# Altium project ledbrick_plus_led.PrjPcb
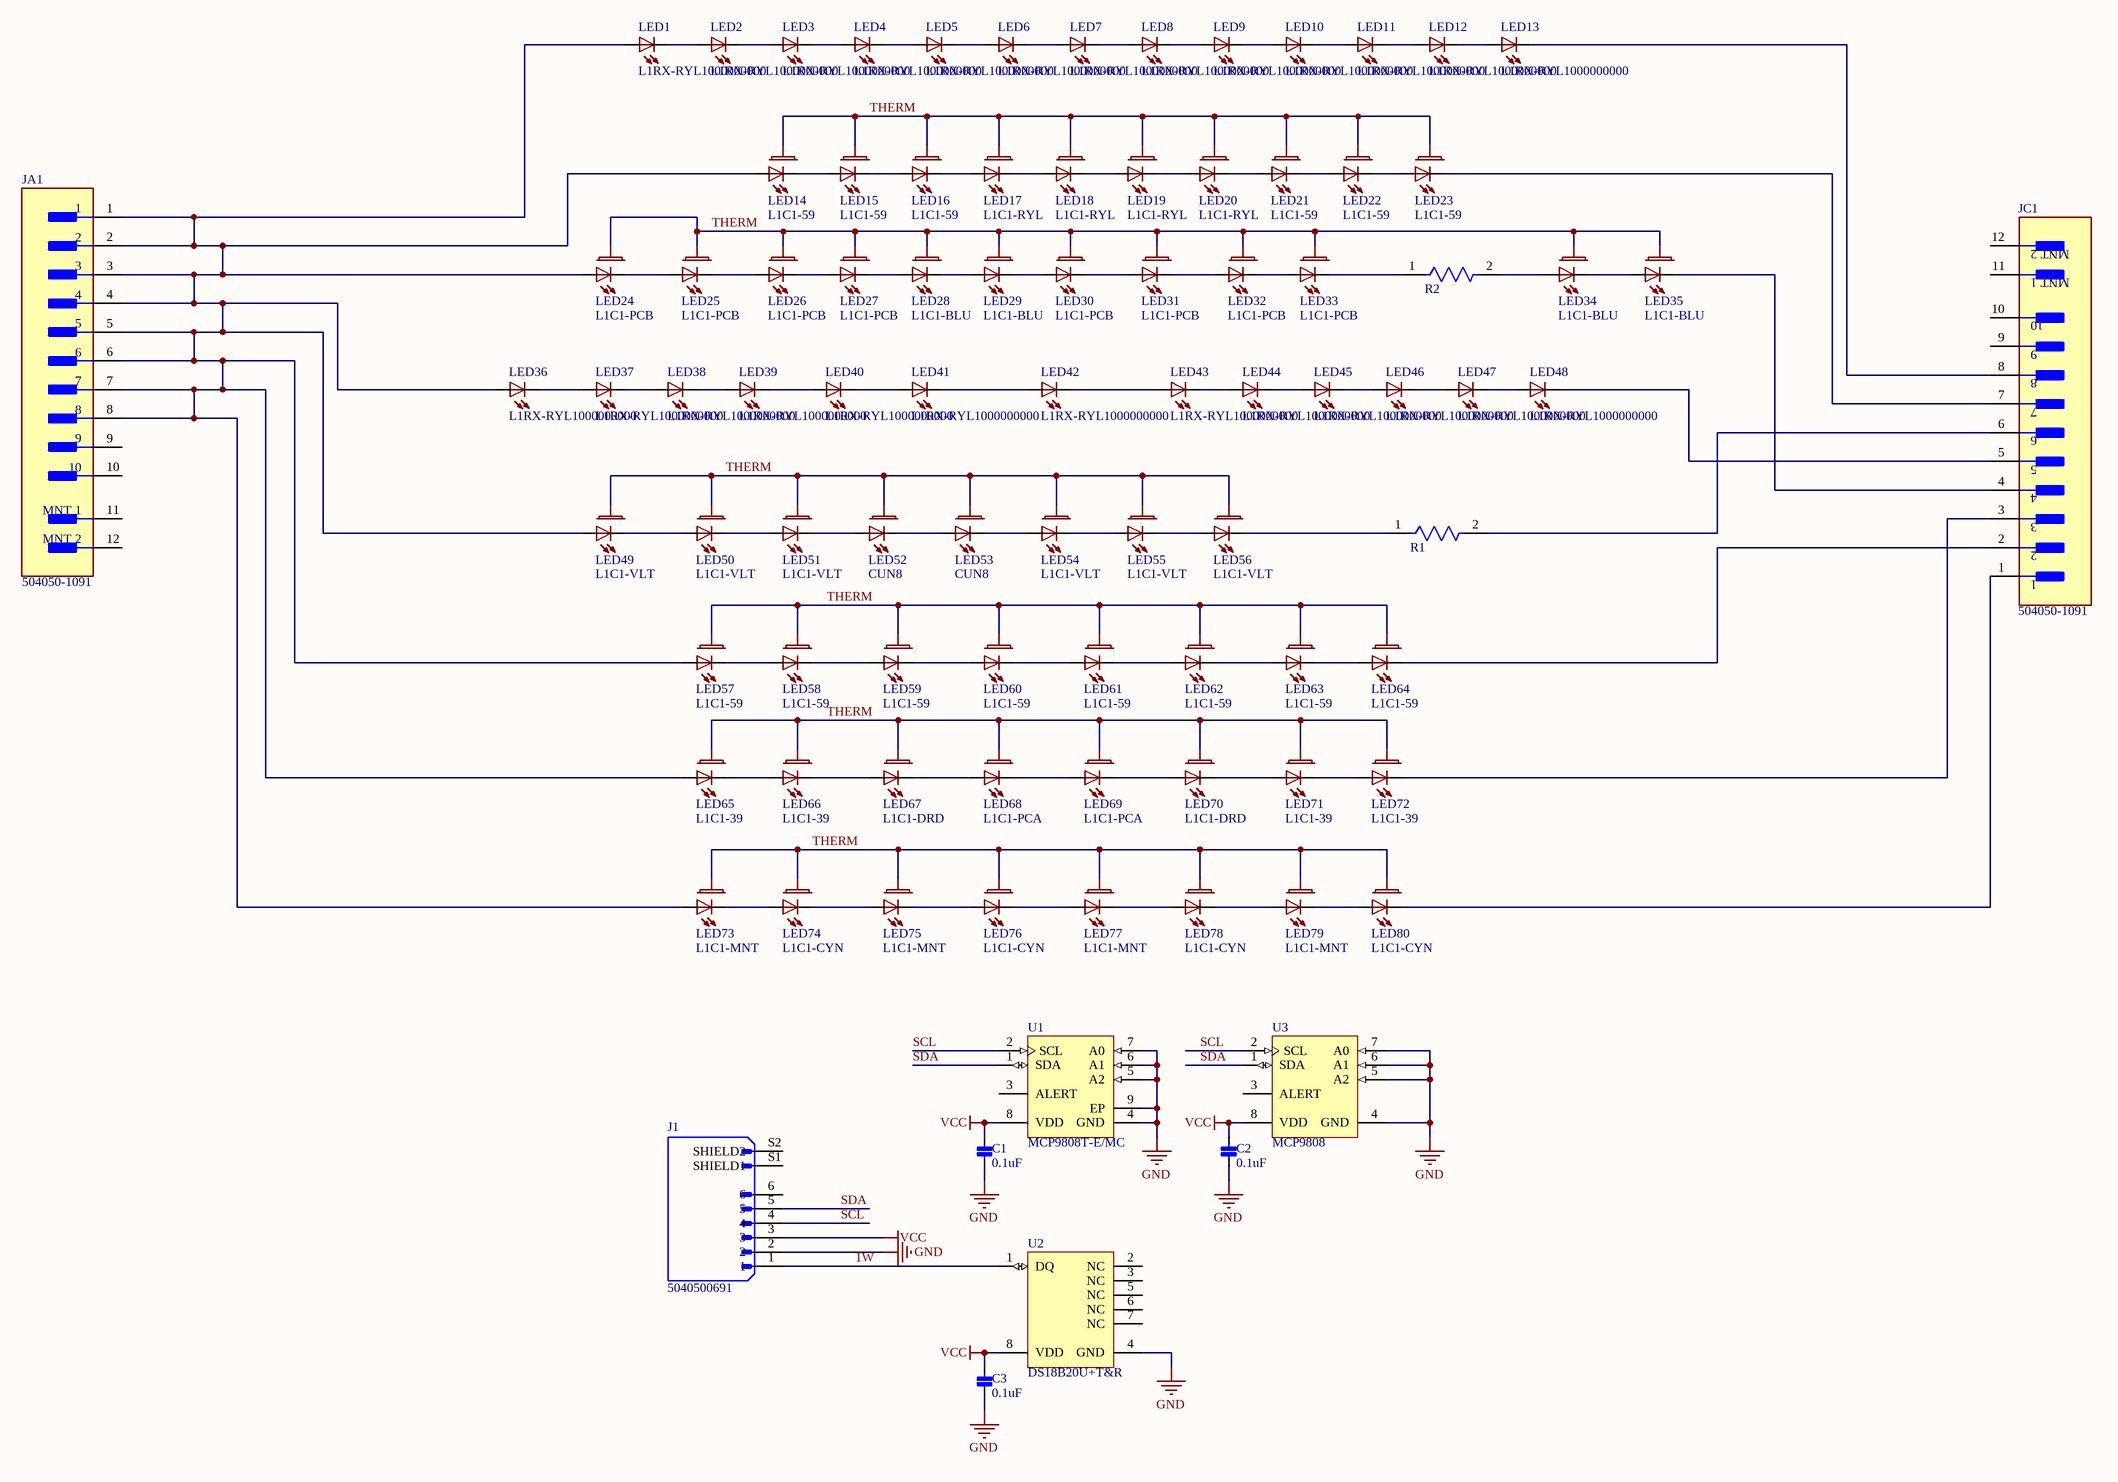
[diagram p0: ledbrick_plus_led.SchDoc]
1 sheet, 91 parts. Net scope: global (net labels, ports and power ports of the same name join across sheets).
Board file: ledbrick_plus_led.PcbDoc

## Sheet ledbrick_plus_led.SchDoc
size C; SheetNumber: 1; SheetTotal: 1

### Parts
C1  value 0.1uF  [FP-CL10-IPC_B]  (hidden comment: CAP 0.1uF 50V X7R 0603)
C2  value 0.1uF  [FP-CL10-IPC_B]  (hidden comment: CAP 0.1uF 50V X7R 0603)
C3  value 0.1uF  [FP-CL10-IPC_B]  (hidden comment: CAP 0.1uF 50V X7R 0603)
J1  5040500691  [MOLEX_5040500691]
JA1  504050-1091  [FP-504050-1091-MFG]
JC1  504050-1091  [FP-504050-1091-MFG]
LED1  L1RX-RYL1000000000  [L1RX-RYL1000000000-Footprint-1]
LED2  L1RX-RYL1000000000  [L1RX-RYL1000000000-Footprint-1]
LED3  L1RX-RYL1000000000  [L1RX-RYL1000000000-Footprint-1]
LED4  L1RX-RYL1000000000  [L1RX-RYL1000000000-Footprint-1]
LED5  L1RX-RYL1000000000  [L1RX-RYL1000000000-Footprint-1]
LED6  L1RX-RYL1000000000  [L1RX-RYL1000000000-Footprint-1]
LED7  L1RX-RYL1000000000  [L1RX-RYL1000000000-Footprint-1]
LED8  L1RX-RYL1000000000  [L1RX-RYL1000000000-Footprint-1]
LED9  L1RX-RYL1000000000  [L1RX-RYL1000000000-Footprint-1]
LED10  L1RX-RYL1000000000  [L1RX-RYL1000000000-Footprint-1]
LED11  L1RX-RYL1000000000  [L1RX-RYL1000000000-Footprint-1]
LED12  L1RX-RYL1000000000  [L1RX-RYL1000000000-Footprint-1]
LED13  L1RX-RYL1000000000  [L1RX-RYL1000000000-Footprint-1]
LED14  L1C1-59  [LUXEON_C_DATASHEET]
LED15  L1C1-59  [LUXEON_C_DATASHEET]
LED16  L1C1-59  [LUXEON_C_DATASHEET]
LED17  L1C1-RYL  [LUXEON_C_DATASHEET]
LED18  L1C1-RYL  [LUXEON_C_DATASHEET]
LED19  L1C1-RYL  [LUXEON_C_DATASHEET]
LED20  L1C1-RYL  [LUXEON_C_DATASHEET]
LED21  L1C1-59  [LUXEON_C_DATASHEET]
LED22  L1C1-59  [LUXEON_C_DATASHEET]
LED23  L1C1-59  [LUXEON_C_DATASHEET]
LED24  L1C1-PCB  [LUXEON_C_DATASHEET]
LED25  L1C1-PCB  [LUXEON_C_DATASHEET]
LED26  L1C1-PCB  [LUXEON_C_DATASHEET]
LED27  L1C1-PCB  [LUXEON_C_DATASHEET]
LED28  L1C1-BLU  [LUXEON_C_DATASHEET]
LED29  L1C1-BLU  [LUXEON_C_DATASHEET]
LED30  L1C1-PCB  [LUXEON_C_DATASHEET]
LED31  L1C1-PCB  [LUXEON_C_DATASHEET]
LED32  L1C1-PCB  [LUXEON_C_DATASHEET]
LED33  L1C1-PCB  [LUXEON_C_DATASHEET]
LED34  L1C1-BLU  [LUXEON_C_DATASHEET]
LED35  L1C1-BLU  [LUXEON_C_DATASHEET]
LED36  L1RX-RYL1000000000  [L1RX-RYL1000000000-Footprint-1]
LED37  L1RX-RYL1000000000  [L1RX-RYL1000000000-Footprint-1]
LED38  L1RX-RYL1000000000  [L1RX-RYL1000000000-Footprint-1]
LED39  L1RX-RYL1000000000  [L1RX-RYL1000000000-Footprint-1]
LED40  L1RX-RYL1000000000  [L1RX-RYL1000000000-Footprint-1]
LED41  L1RX-RYL1000000000  [L1RX-RYL1000000000-Footprint-1]
LED42  L1RX-RYL1000000000  [L1RX-RYL1000000000-Footprint-1]
LED43  L1RX-RYL1000000000  [L1RX-RYL1000000000-Footprint-1]
LED44  L1RX-RYL1000000000  [L1RX-RYL1000000000-Footprint-1]
LED45  L1RX-RYL1000000000  [L1RX-RYL1000000000-Footprint-1]
LED46  L1RX-RYL1000000000  [L1RX-RYL1000000000-Footprint-1]
LED47  L1RX-RYL1000000000  [L1RX-RYL1000000000-Footprint-1]
LED48  L1RX-RYL1000000000  [L1RX-RYL1000000000-Footprint-1]
LED49  L1C1-VLT  [LUXEON_C_DATASHEET]
LED50  L1C1-VLT  [LUXEON_C_DATASHEET]
LED51  L1C1-VLT  [LUXEON_C_DATASHEET]
LED52  CUN8  [VIOSYS_Z5]
LED53  CUN8  [VIOSYS_Z5]
LED54  L1C1-VLT  [LUXEON_C_DATASHEET]
LED55  L1C1-VLT  [LUXEON_C_DATASHEET]
LED56  L1C1-VLT  [LUXEON_C_DATASHEET]
LED57  L1C1-59  [LUXEON_C_DATASHEET]
LED58  L1C1-59  [LUXEON_C_DATASHEET]
LED59  L1C1-59  [LUXEON_C_DATASHEET]
LED60  L1C1-59  [LUXEON_C_DATASHEET]
LED61  L1C1-59  [LUXEON_C_DATASHEET]
LED62  L1C1-59  [LUXEON_C_DATASHEET]
LED63  L1C1-59  [LUXEON_C_DATASHEET]
LED64  L1C1-59  [LUXEON_C_DATASHEET]
LED65  L1C1-39  [LUXEON_C_DATASHEET]
LED66  L1C1-39  [LUXEON_C_DATASHEET]
LED67  L1C1-DRD  [LUXEON_C_DATASHEET]
LED68  L1C1-PCA  [LUXEON_C_DATASHEET]
LED69  L1C1-PCA  [LUXEON_C_DATASHEET]
LED70  L1C1-DRD  [LUXEON_C_DATASHEET]
LED71  L1C1-39  [LUXEON_C_DATASHEET]
LED72  L1C1-39  [LUXEON_C_DATASHEET]
LED73  L1C1-MNT  [LUXEON_C_DATASHEET]
LED74  L1C1-CYN  [LUXEON_C_DATASHEET]
LED75  L1C1-MNT  [LUXEON_C_DATASHEET]
LED76  L1C1-CYN  [LUXEON_C_DATASHEET]
LED77  L1C1-MNT  [LUXEON_C_DATASHEET]
LED78  L1C1-CYN  [LUXEON_C_DATASHEET]
LED79  L1C1-MNT  [LUXEON_C_DATASHEET]
LED80  L1C1-CYN  [LUXEON_C_DATASHEET]
R1  0R 1206  [FP-RC1206-IPC_B]  (value not drawn)
R2  0R 1206  [FP-RC1206-IPC_B]  (value not drawn)
U1  MCP9808T-E/MC  [MCHP-DFN-MC8_V]
U2  DS18B20U+T&R  [MAXM-U8+1_N]
U3  MCP9808  [MCHP-MSOP-MS8_M]

### Nets
GND: C1.2 C2.2 C3.2 J1.2 U1.4(GND) U1.5(A2) U1.6(A1) U1.7(A0) U1.9(EP) U2.4(GND) U3.4(GND) U3.5(A2) U3.6(A1) U3.7(A0)
VCC: C1.1 C2.1 C3.1 J1.3 U1.8(VDD) U2.8(VDD) U3.8(VDD)
1W: J1.1 U2.1(DQ)
SCL: J1.4 U1.2(SCL) U3.2(SCL)
SDA: J1.5 U1.1(SDA) U3.1(SDA)
THERM: LED14.PAD LED15.PAD LED16.PAD LED17.PAD LED18.PAD LED19.PAD LED20.PAD LED21.PAD LED22.PAD LED23.PAD LED24.PAD LED25.PAD LED26.PAD LED27.PAD LED28.PAD LED29.PAD LED30.PAD LED31.PAD LED32.PAD LED33.PAD LED34.PAD LED35.PAD LED49.PAD LED50.PAD LED51.PAD LED52.PAD LED53.PAD LED54.PAD LED55.PAD LED56.PAD LED57.PAD LED58.PAD LED59.PAD LED60.PAD LED61.PAD LED62.PAD LED63.PAD LED64.PAD LED65.PAD LED66.PAD LED67.PAD LED68.PAD LED69.PAD LED70.PAD LED71.PAD LED72.PAD LED73.PAD LED74.PAD LED75.PAD LED76.PAD LED77.PAD LED78.PAD LED79.PAD LED80.PAD
NetJA1_1: JA1.1 JA1.2 JA1.3 JA1.4 JA1.5 JA1.6 JA1.7 JA1.8 LED1.A LED14.A LED24.A LED36.A LED49.A LED57.A LED65.A LED73.A
NetJC1_1: JC1.1 LED80.C
NetJC1_2: JC1.2 LED64.C
NetJC1_3: JC1.3 LED72.C
NetJC1_4: JC1.4 LED35.C
NetJC1_5: JC1.5 LED48.C
NetJC1_6: JC1.6 R1.2
NetJC1_7: JC1.7 LED23.C
NetJC1_8: JC1.8 LED13.C
NetLED1_C: LED1.C LED2.A
NetLED2_C: LED2.C LED3.A
NetLED3_C: LED3.C LED4.A
NetLED4_C: LED4.C LED5.A
NetLED5_C: LED5.C LED6.A
NetLED6_C: LED6.C LED7.A
NetLED7_C: LED7.C LED8.A
NetLED8_C: LED8.C LED9.A
NetLED9_C: LED9.C LED10.A
NetLED10_C: LED10.C LED11.A
NetLED11_C: LED11.C LED12.A
NetLED12_C: LED12.C LED13.A
NetLED14_C: LED14.C LED15.A
NetLED15_C: LED15.C LED16.A
NetLED16_C: LED16.C LED17.A
NetLED17_C: LED17.C LED18.A
NetLED18_C: LED18.C LED19.A
NetLED19_C: LED19.C LED20.A
NetLED20_C: LED20.C LED21.A
NetLED21_C: LED21.C LED22.A
NetLED22_C: LED22.C LED23.A
NetLED24_C: LED24.C LED25.A
NetLED25_C: LED25.C LED26.A
NetLED26_C: LED26.C LED27.A
NetLED27_C: LED27.C LED28.A
NetLED28_C: LED28.C LED29.A
NetLED29_C: LED29.C LED30.A
NetLED30_C: LED30.C LED31.A
NetLED31_C: LED31.C LED32.A
NetLED32_C: LED32.C LED33.A
NetLED33_C: LED33.C R2.1
NetLED34_A: LED34.A R2.2
NetLED34_C: LED34.C LED35.A
NetLED36_C: LED36.C LED37.A
NetLED37_C: LED37.C LED38.A
NetLED38_C: LED38.C LED39.A
NetLED39_C: LED39.C LED40.A
NetLED40_C: LED40.C LED41.A
NetLED41_C: LED41.C LED42.A
NetLED42_C: LED42.C LED43.A
NetLED43_C: LED43.C LED44.A
NetLED44_C: LED44.C LED45.A
NetLED45_C: LED45.C LED46.A
NetLED46_C: LED46.C LED47.A
NetLED47_C: LED47.C LED48.A
NetLED49_C: LED49.C LED50.A
NetLED50_C: LED50.C LED51.A
NetLED51_C: LED51.C LED52.A
NetLED52_C: LED52.C LED53.A
NetLED53_C: LED53.C LED54.A
NetLED54_C: LED54.C LED55.A
NetLED55_C: LED55.C LED56.A
NetLED56_C: LED56.C R1.1
NetLED57_C: LED57.C LED58.A
NetLED58_C: LED58.C LED59.A
NetLED59_C: LED59.C LED60.A
NetLED60_C: LED60.C LED61.A
NetLED61_C: LED61.C LED62.A
NetLED62_C: LED62.C LED63.A
NetLED63_C: LED63.C LED64.A
NetLED65_C: LED65.C LED66.A
NetLED66_C: LED66.C LED67.A
NetLED67_C: LED67.C LED68.A
NetLED68_C: LED68.C LED69.A
NetLED69_C: LED69.C LED70.A
NetLED70_C: LED70.C LED71.A
NetLED71_C: LED71.C LED72.A
NetLED73_C: LED73.C LED74.A
NetLED74_C: LED74.C LED75.A
NetLED75_C: LED75.C LED76.A
NetLED76_C: LED76.C LED77.A
NetLED77_C: LED77.C LED78.A
NetLED78_C: LED78.C LED79.A
NetLED79_C: LED79.C LED80.A

Not connected (* = marked no-connect by the designer): J1 6 S1(SHIELD1) S2(SHIELD2); JA1 9 10 11(MNT_1) 12(MNT_2); JC1 9 10 11(MNT_1) 12(MNT_2); U1 3(ALERT); U2 2(NC) 3(NC) 5(NC) 6(NC) 7(NC); U3 3(ALERT)

### Library data of the parts
C1-C3 = CMP-001-00084-7: Cap Ceramic 0.1uF 50V X7R 20% SMD 0603 125C Paper T/R; Voltage: 50V
J1 = CMP-253-000000-2: CONN WIRE TO BOARD RA 6POS; Number of Circuits: 6; Gender: Male; Voltage Rating: 150V; Connector Type: Blade Pin; Current Rating: 3A; Glow Wire Compliant: Non-compliant; Pitch: 1.5mm; Component Type: Standard; Pin Count: 8; Housing Color: Black; Min Operating Temperature: -25°C; Halogen Free: Low Halogen; Value: *; Number of Positions: 6; Orientation: Right Angle; Color: Black; Design Item ID: 5040500691; Availability: Unavailable; Price: None; Max Operating Temperature: 85°C; Packaging: Tape and Reel; Length: 13.55mm; Number of Rows: 1; Contact Gender: Male; Number of Contacts: 6; Contact Plating: Gold; Package Quantity: 2700; Radiation Hardening: No; Termination: SMD/SMT; Contact Material: Copper Alloy,Copper; Source: 5040500691.SchLib; RoHS Compliant: Yes; Housing Material: Thermoplastic; MP: 5040500691; Flammability Rating: UL94 V-0; Mounting Technology: Surface Mount; Package: None; Depth: 6.44mm
JA1 JC1 = CMP-002-00088-1: Conn Wire to Board HDR 10 POS 1.5mm Solder RA SMD Pico-Lock™ T/R
LED1-LED13 LED36-LED48 = CMP-007-00052-3: LUXEON Rubix High Power LED Royal Blue Square Surface Mount 1635 lm 1.5 A 3.16 V; Forward Current: 3A; Number of Circuits: 1; Peak Wavelength: 447.5nm; Viewing Angle: 125°; Forward Voltage: 3.5V; RoHS: Compliant; Terminal Pitch: 725µm; Mounting Technology: Surface Mount; Lifecycle Status: Production; REACH SVHC: Yes; Height: 780µm; Number of Terminals: 2; Shape: Square
LED14-LED35 LED49-LED80 = CMP-124-0001-3: Source: high-power-led.SCHLIB; Design Item ID: LED_THERMAL
R1 R2 = CMP-009-00181-1: Res Jumper Thick Film 1206 0 Ohm 5% 1/4W Molded SMD Paper T/R; Max Power Dissipation: 250mW; Resistance: 0mR; Voltage Rating: 200V; Temperature Coefficient: 200ppm/°C; Number of Terminations: 2; Case Code (Imperial): 1206; Width: 0.063inch; Case/Package: 1206; Package Quantity: 5000; Lead Free: Lead Free; REACH SVHC: Unknown; Contact Plating: Tin,Matte; Termination: SMD/SMT; Military Standard: Not; Radiation Hardening: No; Tolerance: 5%; Height: 0.026inch; Case Code (Metric): 3216; Depth: 1.6mm; Resistor Type: Thick Film,Carbon Film; Packaging: Tape and Reel; Power Rating: 250mW; Min Operating Temperature: -55°C; Length: 3.1mm; Max Operating Temperature: 155°C
U1 = CMP-010-00024-2: Temp Sensor Digital Serial (2-Wire, I2C) 8-Pin DFN EP T/R; Output Current: 200uA; Number of Bits: 16; Output Type: I2C,Digital; Max Supply Voltage (DC): 5.5V; Min Supply Voltage (DC): 2.7V; Resolution: 10b; Interface: I2C,SMBus,2-Wire,Serial; Nominal Supply Current: 200uA; Contact Plating: Tin,Matte; Operating Supply Current: 200uA; Packaging: Tape and Reel; Package Quantity: 3300; Max Operating Temperature: 125°C; Case/Package: DFN; REACH SVHC: No SVHC; Number of Pins: 8; Max Supply Voltage: 5.5V; Min Operating Temperature: -40°C; Radiation Hardening: No; Lead Free: Lead Free; Min Supply Voltage: 2.7V
U2 = CMP-010-00025-1: Temp Sensor Digital Serial (1-Wire) 8-Pin uMAX T/R; Interface: 1-WIRE,Serial; Case/Package: UMAX; Contact Plating: Tin,Matte; Lead Free: Lead Free
U3 = CMP-114-0012-2: Temp Sensor Digital Serial (2-Wire, I2C) 8-Pin MSOP Tube; Min Supply Voltage: 2.7V; Max Supply Voltage: 5.5V; Resolution: 10b; Number of Bits: 16; Output Type: I2C,Digital; Nominal Supply Current: 200uA; Interface: I2C,SMBus,2-Wire,Serial; Lead Free: Lead Free; Max Operating Temperature: 125°C; Width: 3mm; Number of Pins: 8; Height: 0.95mm; Min Operating Temperature: -40°C; Case/Package: MSOP; Min Supply Voltage (DC): 2.7V; Max Supply Voltage (DC): 5.5V; Output Current: 200uA; Radiation Hardening: No; Length: 3mm; REACH SVHC: No SVHC; Packaging: Rail/Tube; Package Quantity: 100